# EAGLE design 5VAC-Dc (EAGLE 9.6.2)
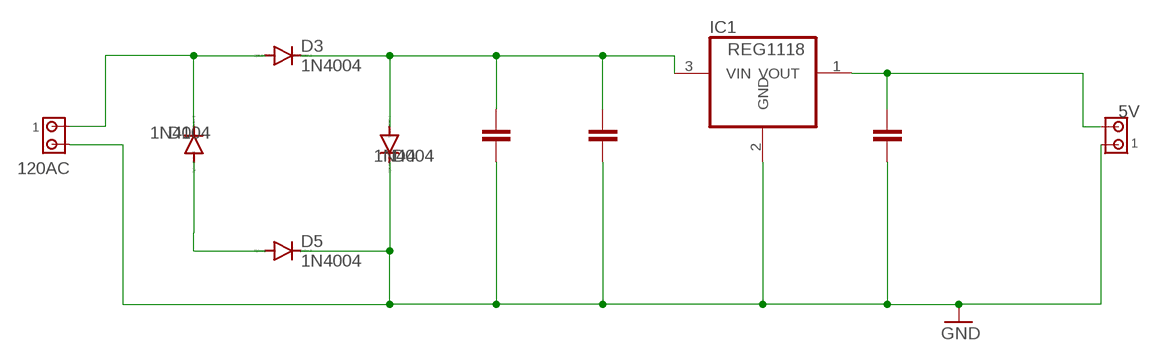
[diagram p0: schematic, sheet 1]

## Parts
5V  1445055-2  [1445055-2]
D1  1N4004  [DO41-10]
D3  1N4004  [DO41-10]
D4  1N4004  [DO41-10]
D5  1N4004  [DO41-10]
IC1  REG1118  [SOT223]
J1  120AC  1445055-2  [1445055-2]

## Nets
GND: 5V.1 D4.C D5.C IC1.2(GND) J1.2
N$1: D1.C D3.A J1.1
N$2: D1.A D5.A
N$4: D3.C D4.A IC1.3(VIN)
N$6: 5V.2 IC1.1(VOUT)

## Library data of the parts
5V J1 = con-amp:1445055-2: Micro MATE-N-LOK Connectors grid 1.5 mm Source: ENG_CD_1445055_A.pdf
D1 D3-D5 = diode:1N4004: DIODE general purpose rectifier, 1 A
IC1 = burr-brown:REG1118: 800mA Low Dropout (LDO) Positive Regulator with Current Source and Sink Capability; MPN: REG1118-2.85/2K5G4; OC_FARNELL: unknown; OC_NEWARK: 14M2185

## Board
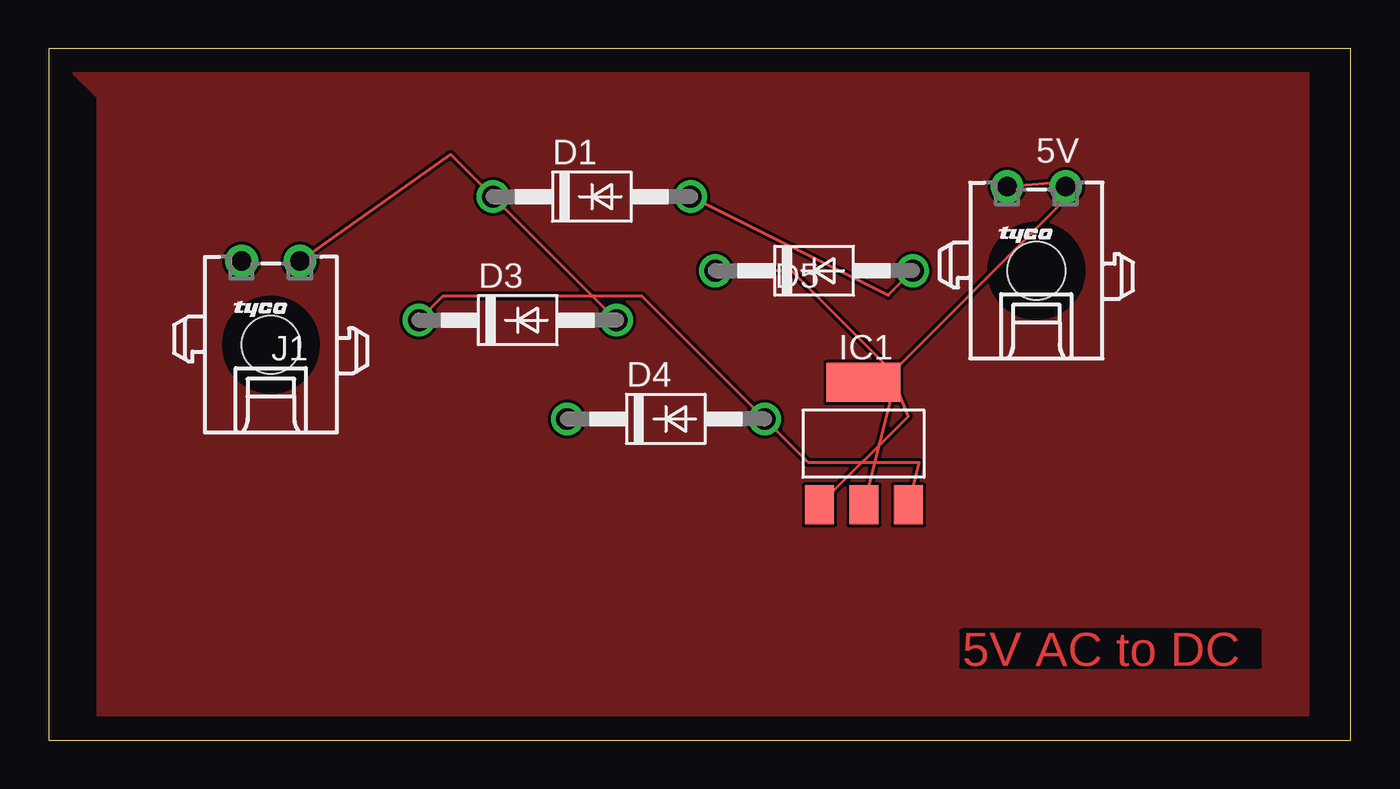
[diagram p1: board, top side]
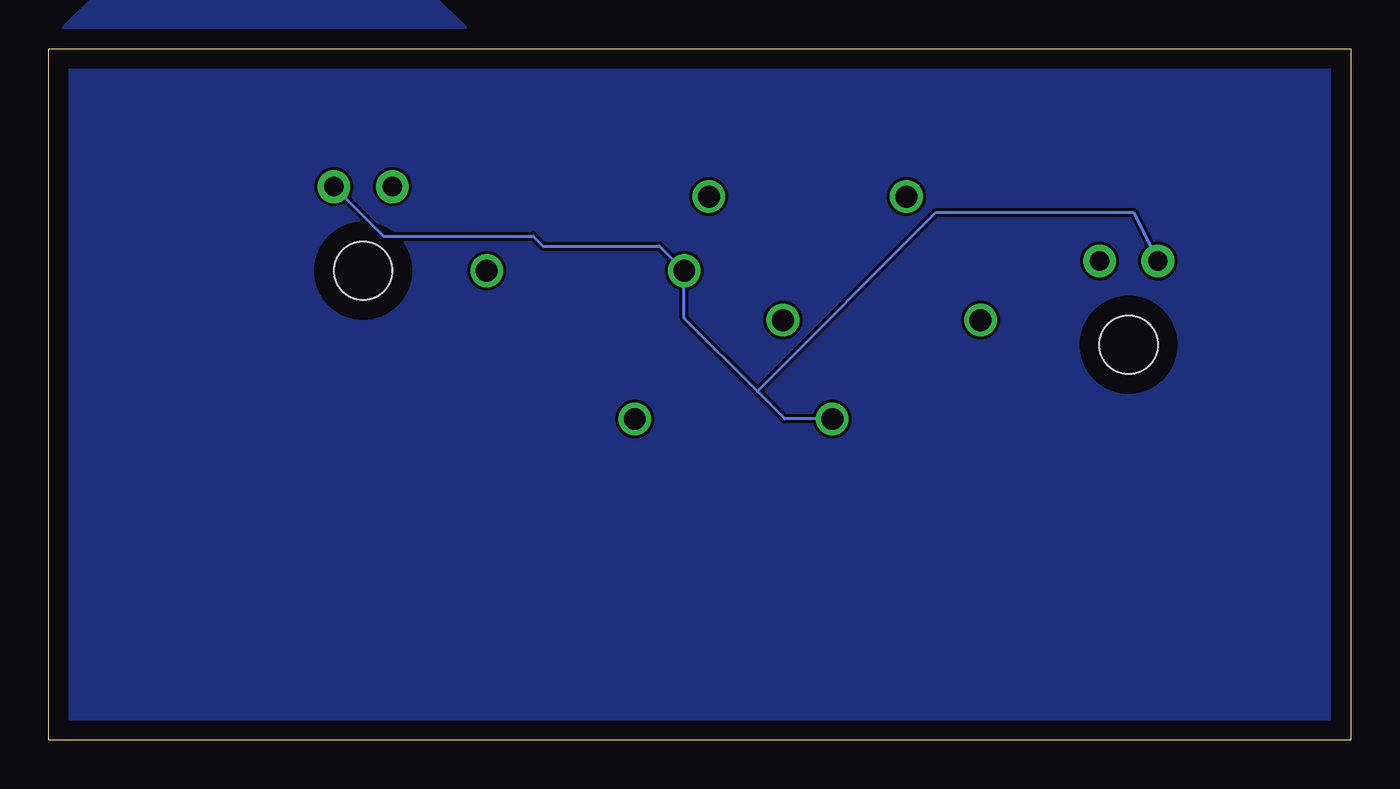
[diagram p2: board, bottom side, seen from below]

Size 66.98 x 35.55 mm. Coordinates in mm from the lower left corner, seen from the top.
Outline: 0,0 66.98,0 66.98,35.55 0,35.55 0,0
Copper layers (1*16): Top 0.035mm / dielectric 1.5mm / Bottom 0.035mm
Design rules "default": minimum track width 6mil, minimum drill 0.35mm, track to track 6mil, track to pad 6mil, pad to pad 6mil, via to via 6mil, smd to smd 6mil, copper to edge 40mil, drill to drill 6mil, minimum pad ring 10mil, minimum via ring 8mil, stop-mask expansion 4mil, vias tented up to drill 0mil, thermal gap 10mil

### Footprints (pad centres in the part's own frame; a part is rotated, then mirrored left to right if it is on the bottom)
1445055-2 = drill 1 pad 1.676: 1 1.5,4.32; 2 -1.5,4.32 | hole 3: 0,0
DO41-10 = drill 1.118: A 5.08,0; C -5.08,0
SOT223 = smd 1.499 x 2.007: 1 -2.261,-3.15; 2 0.025,-3.15; 3 2.311,-3.15 | smd 3.81 x 2.007: 4 0,3.15

### Placement (x,y rotation side)
5V  50.8,24.13 0 top
D1  27.94,27.94 0 top
D3  24.13,21.59 0 top
D4  31.75,16.51 0 top
D5  39.37,24.13 0 top
IC1  41.91,15.24 0 top
J1  11.43,20.32 0 top

### Tracks (layer width: path | path; a pad name or v marks a point on that pad's centre or on a via)
AC
  pour Top: 1.27,34.29 64.77,34.29 64.77,1.27 2.54,1.27 2.54,33.02
BV
  pour Bottom: 0,35.56 0,0 67.31,0 67.31,35.56 63.5,39.37 48.26,39.37 44.45,35.56
GND
  Top 0.152: IC1.2 43.6,18.73 38.2,24.13 D5.C
  Bottom 0.152: 30.53,17.93 34.29,21.69 D5.C 35.56,25.4 41.55,25.4 42.06,25.91 49.76,25.91 5V.1 | 30.53,17.93 29.11,16.51 D4.C | 30.53,17.93 21.34,27.13 11.19,27.13 J1.2
N$1
  Top 0.152: D3.A D1.C 20.69,30.11 J1.1
N$2
  Top 0.152: D5.A 43.18,22.86 D1.A
N$4
  Top 0.152: IC1.3 44.77,14.28 39.06,14.28 D4.A 30.53,22.81 20.27,22.81 D3.C
N$6
  Top 0.152: IC1.1 44.22,16.66 43.59,18.24 43.59,19.1 51.87,27.38 51.87,28.66 5V.2

### Text on the board
Top: 5V AC to DC